# EAGLE design 1601_board_firmata_ft231x (EAGLE 9.6.2)
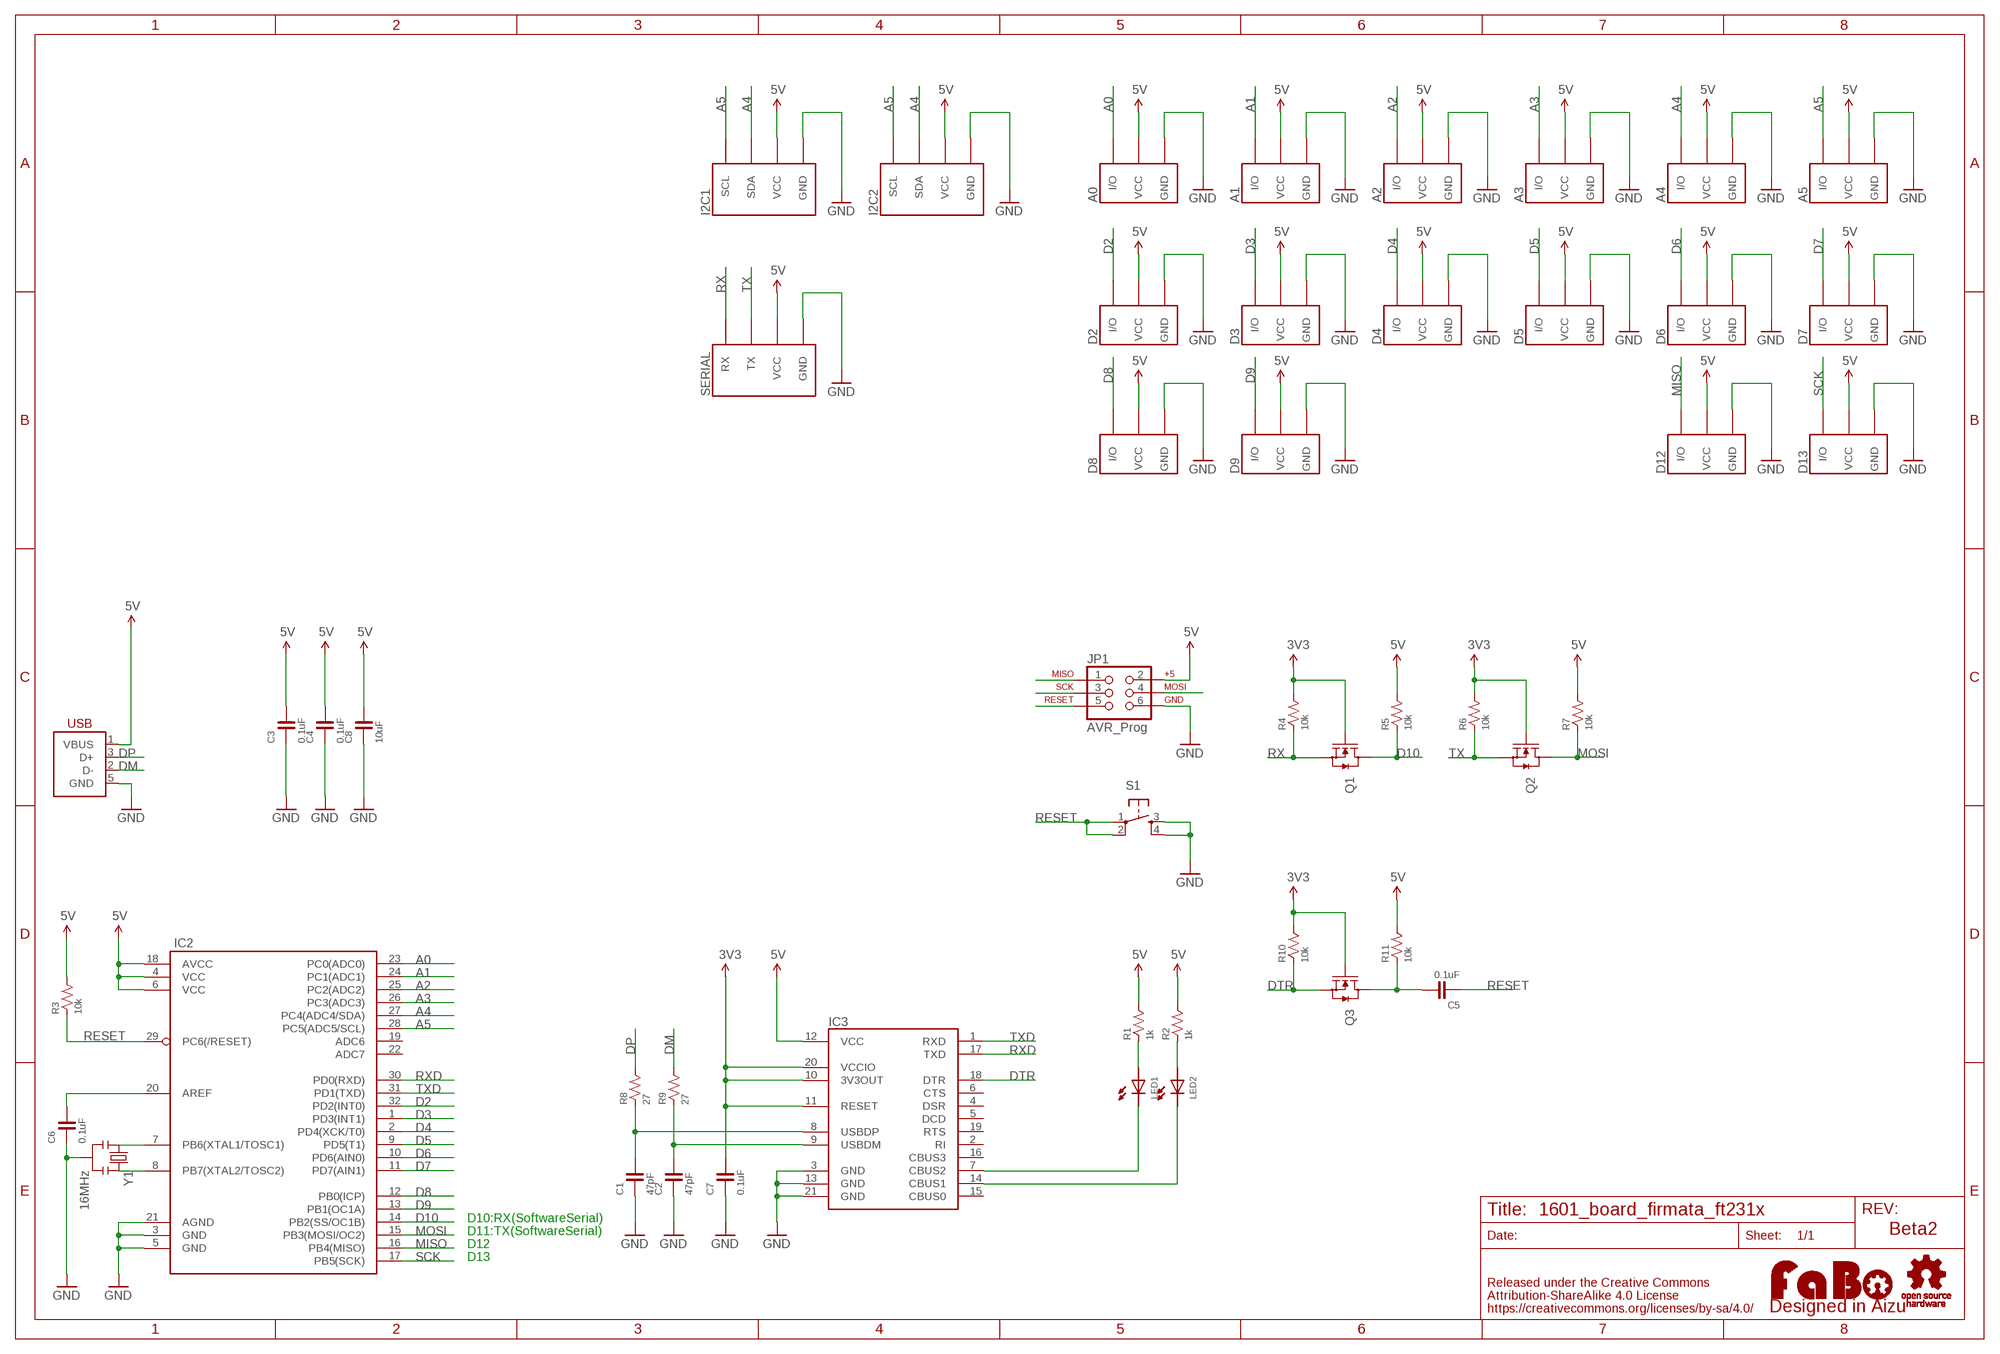
[diagram p0: schematic, sheet 1]

## Parts
A0  FABO_BRICK_3PIN-S03B-PASK-2  [FABO_BRICK_3PIN_S03B-PASK-2]
A1  FABO_BRICK_3PIN-S03B-PASK-2  [FABO_BRICK_3PIN_S03B-PASK-2]
A2  FABO_BRICK_3PIN-S03B-PASK-2  [FABO_BRICK_3PIN_S03B-PASK-2]
A3  FABO_BRICK_3PIN-S03B-PASK-2  [FABO_BRICK_3PIN_S03B-PASK-2]
A4  FABO_BRICK_3PIN-S03B-PASK-2  [FABO_BRICK_3PIN_S03B-PASK-2]
A5  FABO_BRICK_3PIN-S03B-PASK-2  [FABO_BRICK_3PIN_S03B-PASK-2]
C1  47pF  CAPACITOR-0603  [0603]
C2  47pF  CAPACITOR-0603  [0603]
C3  0.1uF  CAPACITOR-0603  [0603]
C4  0.1uF  CAPACITOR-0603  [0603]
C5  0.1uF  CAPACITOR-0603  [0603]
C6  0.1uF  CAPACITOR-0603  [0603]
C7  0.1uF  CAPACITOR-0603  [0603]
C8  10uF  CAPACITOR-0603  [0603]
D2  FABO_BRICK_3PIN-B03B-PASK-1  [FABO_BRICK_3PIN_B03B-PASK-1]
D3  FABO_BRICK_3PIN-B03B-PASK-1  [FABO_BRICK_3PIN_B03B-PASK-1]
D4  FABO_BRICK_3PIN-B03B-PASK-1  [FABO_BRICK_3PIN_B03B-PASK-1]
D5  FABO_BRICK_3PIN-B03B-PASK-1  [FABO_BRICK_3PIN_B03B-PASK-1]
D6  FABO_BRICK_3PIN-B03B-PASK-1  [FABO_BRICK_3PIN_B03B-PASK-1]
D7  FABO_BRICK_3PIN-B03B-PASK-1  [FABO_BRICK_3PIN_B03B-PASK-1]
D8  FABO_BRICK_3PIN-B03B-PASK-1  [FABO_BRICK_3PIN_B03B-PASK-1]
D9  FABO_BRICK_3PIN-B03B-PASK-1  [FABO_BRICK_3PIN_B03B-PASK-1]
D12  FABO_BRICK_3PIN-B03B-PASK-1  [FABO_BRICK_3PIN_B03B-PASK-1]
D13  FABO_BRICK_3PIN-B03B-PASK-1  [FABO_BRICK_3PIN_B03B-PASK-1]
I2C1  FABO_BRICK_I2C-S04B-PASK-2  [FABO_BRICK_I2C_S04B-PASK-2]
I2C2  FABO_BRICK_I2C-S04B-PASK-2  [FABO_BRICK_I2C_S04B-PASK-2]
IC2  ATMEGA328P-AU-TQFP32  [TQFP-32-08]
IC3  FT231XQ  [QFN-20]
JP1  AVR_Prog  AVR_ISP-TC  [TC2030-MCP]
LED1  LED-0603  [0603]
LED2  LED-0603  [0603]
Q1  MOSFET-N-BSS138  [SOT23-3]
Q2  MOSFET-N-BSS138  [SOT23-3]
Q3  MOSFET-N-BSS138  [SOT23-3]
R1  1k  RESISTOR-0603  [0603]
R2  1k  RESISTOR-0603  [0603]
R3  10k  RESISTOR-0603  [0603]
R4  10k  RESISTOR-0603  [0603]
R5  10k  RESISTOR-0603  [0603]
R6  10k  RESISTOR-0603  [0603]
R7  10k  RESISTOR-0603  [0603]
R8  27  RESISTOR-0603  [0603]
R9  27  RESISTOR-0603  [0603]
R10  10k  RESISTOR-0603  [0603]
R11  10k  RESISTOR-0603  [0603]
S1  TACT-SWITCH-SMD_KMR2  [KMR2]
SERIAL  FABO_BRICK_SERIAL-S04B-PASK-2  [FABO_BRICK_SERIAL_S04B-PASK-2]
U$2  LOGO_OSHW-T_M_BOTTOM  [LOGO_OSHW_T_MS_BOTTOM]
U$3  LOGO_FABO-M  [LOGO_FABO_MS]
USB2  USB-MICRO_B_SMT  [DX4R005JJ2R1800]
Y1  16MHz  RESONATOR  [RESONATOR_SMD]

## Nets
3V3: C7.2 IC3.10(3V3OUT) IC3.11(RESET) IC3.20(VCCIO) Q1.1(G) Q2.1(G) Q3.1(G) R4.2 R6.2 R10.2
5V: A0.VCC A1.VCC A2.VCC A3.VCC A4.VCC A5.VCC C3.2 C4.2 C8.2 D2.VCC D3.VCC D4.VCC D5.VCC D6.VCC D7.VCC D8.VCC D9.VCC D12.VCC D13.VCC I2C1.VCC I2C2.VCC IC2.4(VCC) IC2.6(VCC) IC2.18(AVCC) IC3.12(VCC) JP1.2 R1.2 R2.2 R3.2 R5.2 R7.2 R11.2 SERIAL.VCC USB2.1(VBUS)
A0: A0.I/O IC2.23(PC0(ADC0))
A1: A1.I/O IC2.24(PC1(ADC1))
A2: A2.I/O IC2.25(PC2(ADC2))
A3: A3.I/O IC2.26(PC3(ADC3))
A4: A4.I/O I2C1.SDA I2C2.SDA IC2.27(PC4(ADC4/SDA))
A5: A5.I/O I2C1.SCL I2C2.SCL IC2.28(PC5(ADC5/SCL))
D2: D2.I/O IC2.32(PD2(INT0))
D3: D3.I/O IC2.1(PD3(INT1))
D4: D4.I/O IC2.2(PD4(XCK/T0))
D5: D5.I/O IC2.9(PD5(T1))
D6: D6.I/O IC2.10(PD6(AIN0))
D7: D7.I/O IC2.11(PD7(AIN1))
D8: D8.I/O IC2.12(PB0(ICP))
D9: D9.I/O IC2.13(PB1(OC1A))
D10: IC2.14(PB2(SS/OC1B)) Q1.3(D) R5.1
DM: R9.2 USB2.2(D-)
DP: R8.2 USB2.3(D+)
DTR: IC3.18(DTR) Q3.2(S) R10.1
GND: A0.GND A1.GND A2.GND A3.GND A4.GND A5.GND C1.1 C2.1 C3.1 C4.1 C6.1 C7.1 C8.1 D2.GND D3.GND D4.GND D5.GND D6.GND D7.GND D8.GND D9.GND D12.GND D13.GND I2C1.GND I2C2.GND IC2.3(GND) IC2.5(GND) IC2.21(AGND) IC3.3(GND) IC3.13(GND) IC3.21(GND) JP1.6 S1.3 S1.4 SERIAL.GND USB2.5(GND) Y1.2
MISO: D12.I/O IC2.16(PB4(MISO)) JP1.1
MOSI: IC2.15(PB3(MOSI/OC2)) JP1.4 Q2.3(D) R7.1
N$1: LED1.ANODE R1.1
N$2: C6.2 IC2.20(AREF)
N$3: IC2.8(PB7(XTAL2/TOSC2)) Y1.3
N$4: IC2.7(PB6(XTAL1/TOSC1)) Y1.1
N$5: C1.2 IC3.8(USBDP) R8.1
N$6: C2.2 IC3.9(USBDM) R9.1
N$7: IC3.14(CBUS1) LED2.CATHODE
N$8: IC3.7(CBUS2) LED1.CATHODE
N$9: C5.2 Q3.3(D) R11.1
N$30: LED2.ANODE R2.1
RESET: C5.1 IC2.29(PC6(/RESET)) JP1.5 R3.1 S1.1 S1.2
RX: Q1.2(S) R4.1 SERIAL.RX
RXD: IC2.30(PD0(RXD)) IC3.17(TXD)
SCK: D13.I/O IC2.17(PB5(SCK)) JP1.3
TX: Q2.2(S) R6.1 SERIAL.TX
TXD: IC2.31(PD1(TXD)) IC3.1(RXD)
Unconnected: IC2.19(ADC6) IC2.22(ADC7) IC3.2(RI) IC3.4(DSR) IC3.5(DCD) IC3.6(CTS) IC3.15(CBUS0) IC3.16(CBUS3) IC3.19(RTS)

## Notes on the sheet
- D10:RX(SoftwareSerial)
- D11:TX(SoftwareSerial) | Beta2
- D12
- D13

## Library data of the parts
A0 A1-A5 D2-D9 D12 D13 = FaBo-Template:FABO_BRICK_3PIN: FaBo Brick 3pin
C1-C8 = FaBo-Capacitor:CAPACITOR: CAPACITOR
I2C1 I2C2 = FaBo-Template:FABO_BRICK_I2C: FaBo Brick I2C
IC2 = FaBo-etc:ATMEGA328P-AU: ATmega328p-AU
IC3 = FaBo-etc:FT231X
JP1 = Gclue:AVR_ISP
LED1 LED2 = FaBo-LED:LED
Q1-Q3 = FaBo-etc:MOSFET-N
R1-R11 = FaBo-Resistors:RESISTOR: RESISTOR
S1 = FaBo-Switch:TACT-SWITCH
SERIAL = FaBo-Template:FABO_BRICK_SERIAL: FaBo Brick Serial
U$2 = FaBo-etc:LOGO_OSHW
U$3 = FaBo-Logo:LOGO_FABO
USB2 = FaBo-etc:USB
Y1 = Gclue:RESONATOR: RESONATOR CSTCE16M0V53

## Board
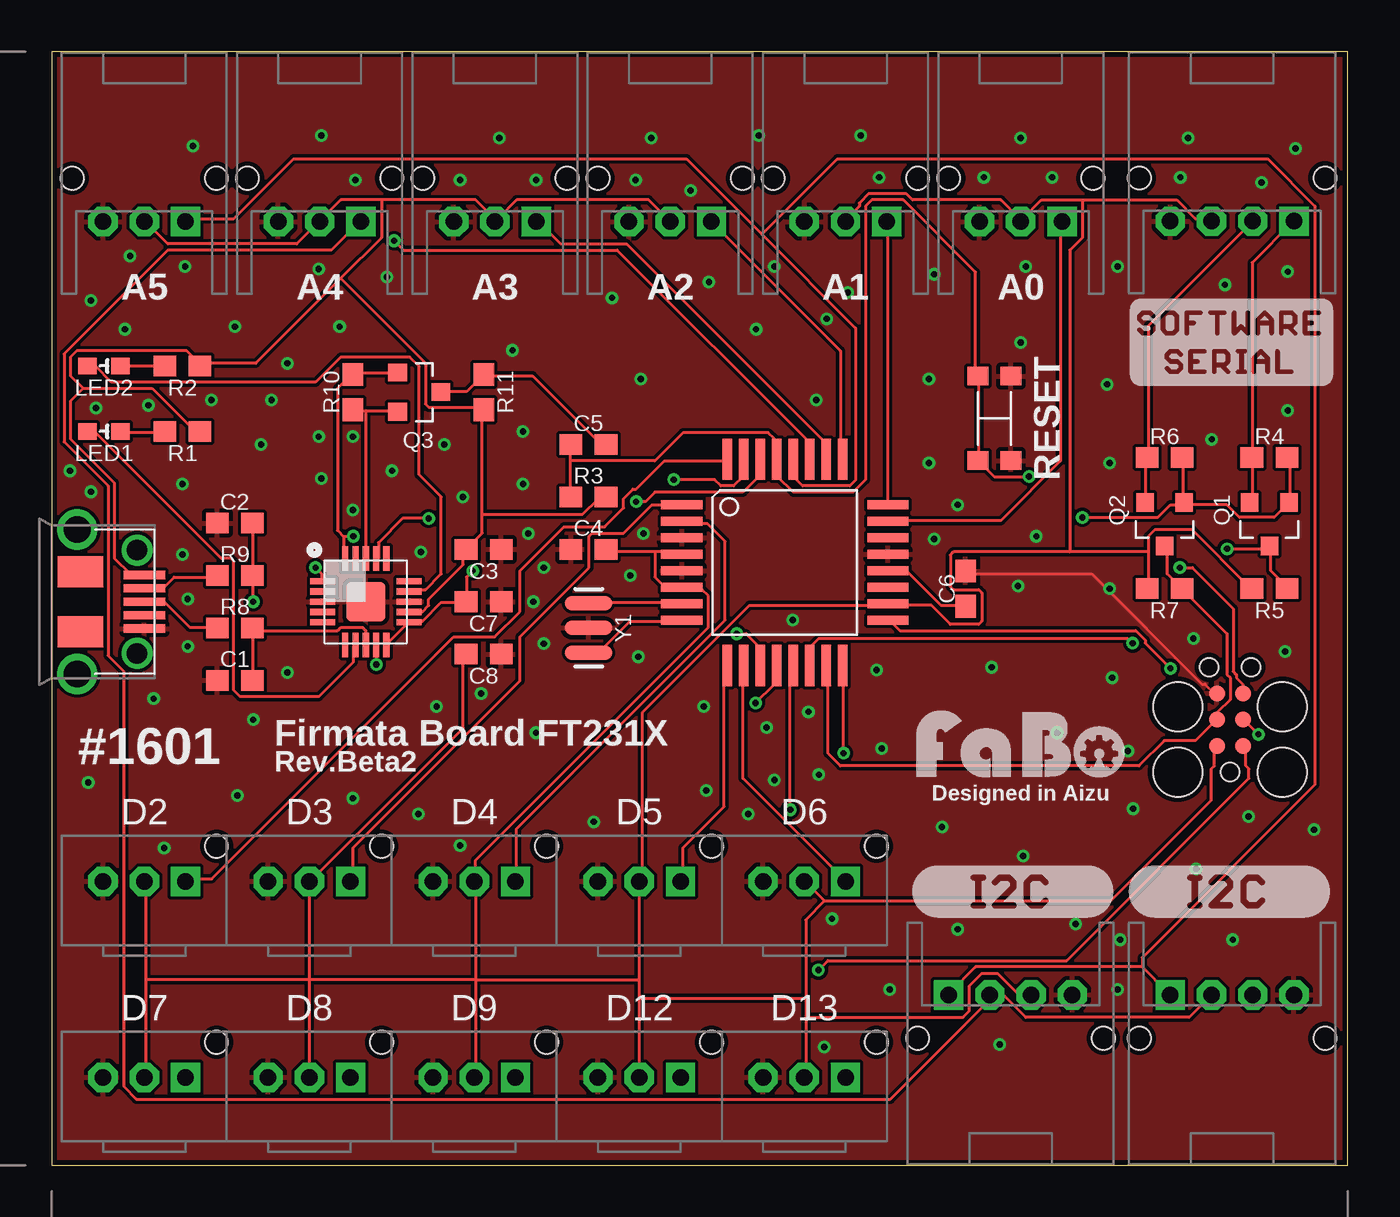
[diagram p1: board, top side]
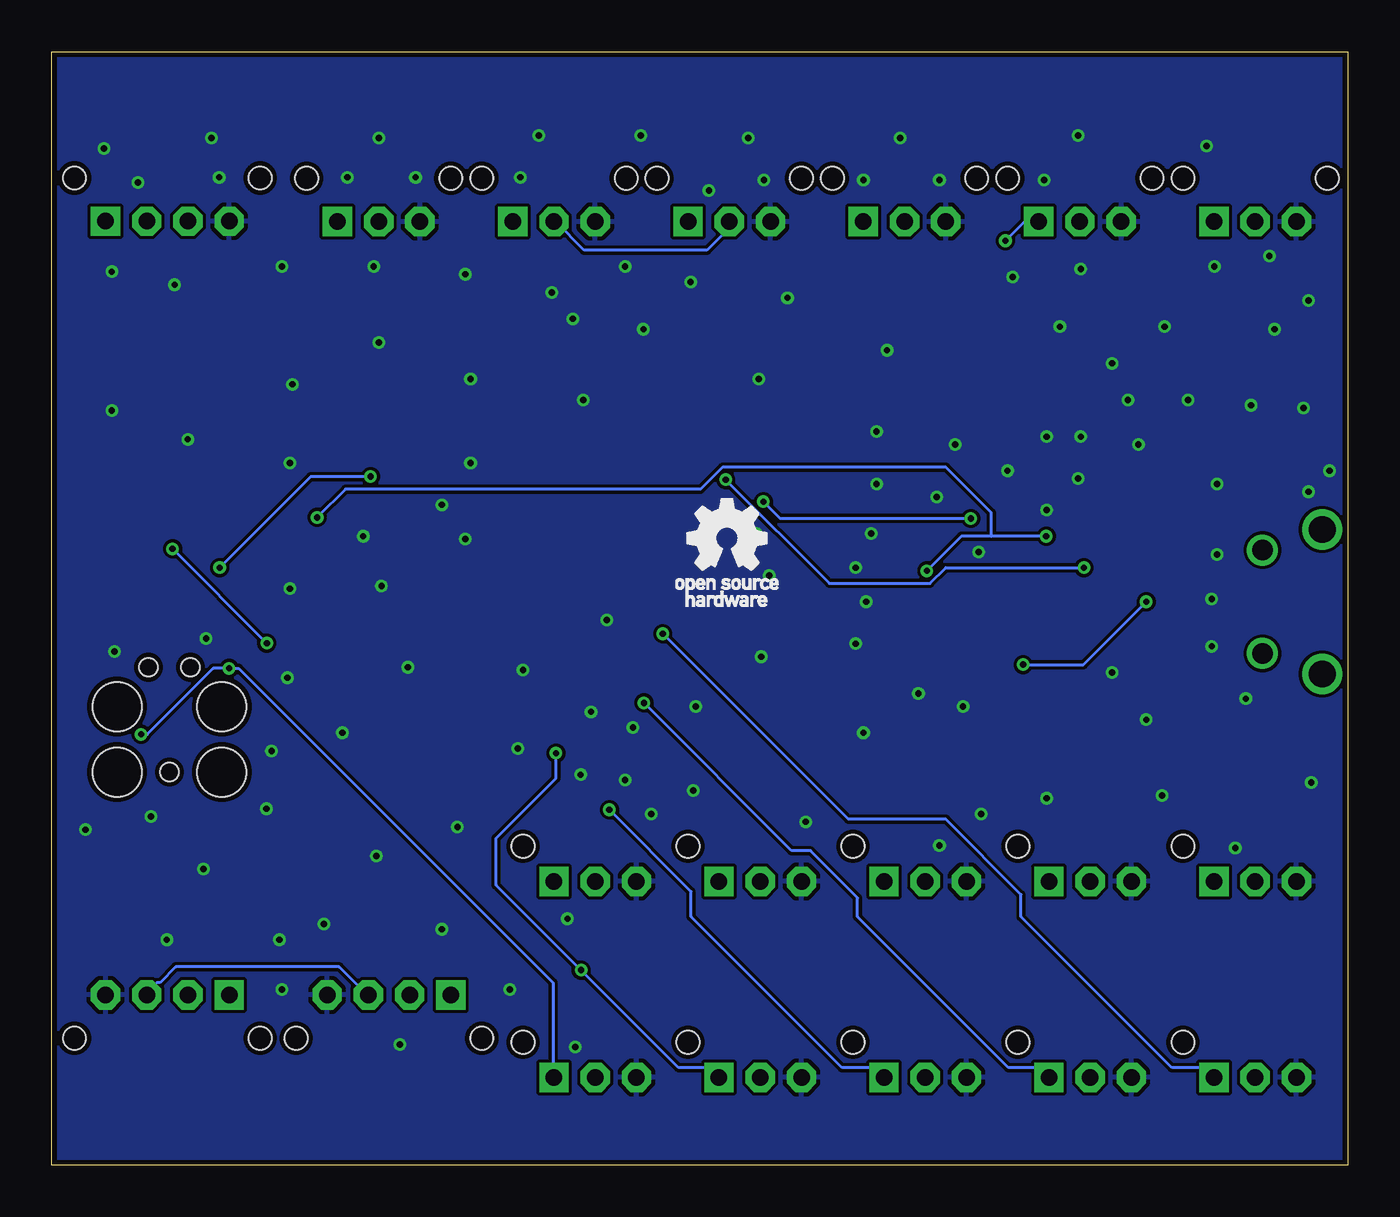
[diagram p2: board, bottom side, seen from below]

Size 62.87 x 53.98 mm. Coordinates in mm from the lower left corner, seen from the top.
Outline: 0,0 62.87,0 62.87,53.98 0,53.98 0,0
Copper layers (1*16): Top 0.035mm / dielectric 1.6mm / Bottom 0.035mm
Design rules "PCBway": minimum track width 6mil, minimum drill 12mil, track to track 6mil, track to pad 6mil, pad to pad 6mil, via to via 6mil, smd to smd 6mil, copper to edge 10mil, drill to drill 10mil, minimum pad ring 10mil, minimum via ring 6mil, stop-mask expansion 2mil, vias tented up to drill 100mil, thermal gap 8mil

### Footprints (pad centres in the part's own frame; a part is rotated, then mirrored left to right if it is on the bottom)
FABO_BRICK_3PIN_S03B-PASK-2 = drill 0.8 pad 1.422 octagon: GND -2,0; VCC 0,0 | drill 0.8 pad 1.422 square: I/O 2,0 | hole 1.1: 3.5,2.1; -3.5,2.1
0603 = smd 1.1 x 1: 1 -0.85,0; 2 0.85,0
FABO_BRICK_3PIN_B03B-PASK-1 = drill 0.8 pad 1.422 octagon: GND -2,0; VCC 0,0 | drill 0.8 pad 1.422 square: I/O 2,0 | hole 1.1: 3.5,1.7
FABO_BRICK_I2C_S04B-PASK-2 = drill 0.8 pad 1.422 octagon: GND -3,0; SDA 1,0; VCC -1,0 | drill 0.8 pad 1.422 square: SCL 3,0 | hole 1.1: 4.5,2.1; -4.5,2.1
TQFP-32-08 = smd 2 x 0.45: 1 -5,2.8; 2 -5,2; 3 -5,1.2; 4 -5,0.4; 5 -5,-0.4; 6 -5,-1.2; 7 -5,-2; 8 -5,-2.8; 17 5,-2.8; 18 5,-2; 19 5,-1.2; 20 5,-0.4; 21 5,0.4; 22 5,1.2; 23 5,2; 24 5,2.8 | smd 0.45 x 2: 9 -2.8,-5; 10 -2,-5; 11 -1.2,-5; 12 -0.4,-5; 13 0.4,-5; 14 1.2,-5; 15 2,-5; 16 2.8,-5; 25 2.8,5; 26 2,5; 27 1.2,5; 28 0.4,5; 29 -0.4,5; 30 -1.2,5; 31 -2,5; 32 -2.8,5
QFN-20 = smd 1.2 x 0.3: 1 -2.1,1; 2 -2.1,0.5; 3 -2.1,0; 4 -2.1,-0.5; 5 -2.1,-1; 11 2.1,-1; 12 2.1,-0.5; 13 2.1,0; 14 2.1,0.5; 15 2.1,1 | smd 0.3 x 1.2: 6 -1,-2.1; 7 -0.5,-2.1; 8 0,-2.1; 9 0.5,-2.1; 10 1,-2.1; 16 1,2.1; 17 0.5,2.1; 18 0,2.1; 19 -0.5,2.1; 20 -1,2.1 | smd 1.9 x 1.9: 21 0,0
TC2030-MCP = smd 0.787 x 0.787: 1 -1.27,-0.635; 2 -1.27,0.635; 3 0,-0.635; 4 0,0.635; 5 1.27,-0.635; 6 1.27,0.635 | hole 0.889: -2.54,0; 2.54,-1.016; 2.54,1.016 | hole 2.375: -2.54,2.54; -2.54,-2.54; 0.635,-2.54; 0.635,2.54
0603' = smd 0.9 x 0.8: ANODE -0.8,0; CATHODE 0.8,0
SOT23-3 = smd 0.85 x 0.9: 1 -0.95,-1; 2 0.95,-1; 3 0,1.1
KMR2 = smd 0.9 x 1: 1 -2.05,0.8; 2 2.05,0.8; 3 2.05,-0.8; 4 -2.05,-0.8
FABO_BRICK_SERIAL_S04B-PASK-2 = drill 0.8 pad 1.422 octagon: GND -3,0; TX 1,0; VCC -1,0 | drill 0.8 pad 1.422 square: RX 3,0 | hole 1.1: 4.5,2.1; -4.5,2.1
DX4R005JJ2R1800 = smd 0.4 x 2: 1 -1.3,4.5; 2 -0.65,4.5; 3 0,4.5; 4 0.65,4.5; 5 1.3,4.5 | smd 1.5 x 2.2: 6 -1.45,1.4; 7 1.45,1.4 | drill 1 pad 1.4: P$1 -2.5,4.15; P$2 2.5,4.15 | drill 1.3 pad 1.7: P$3 -3.5,1.25; P$4 3.5,1.25
RESONATOR_SMD = smd 0.7 x 2.3: 1 -1.2,0; 2 0,0; 3 1.2,0

### Placement (x,y rotation side)
A0  47,45.73 0 top
A1  38.5,45.73 0 top
A2  30,45.73 0 top
A3  21.5,45.73 0 top
A4  13,45.73 0 top
A5  4.5,45.73 0 top
C1  8.89,23.5 0 top
C2  8.89,31.11 0 top
C3  20.95,29.84 180 top
C4  26.04,29.84 0 top
C5  26.04,34.92 0 top
C6  44.32,27.94 270 top
C7  20.95,27.3 180 top
C8  20.95,24.77 180 top
D2  4.5,13.75 0 top
D3  12.5,13.75 0 top
D4  20.5,13.75 0 top
D5  28.5,13.75 0 top
D6  36.5,13.75 0 top
D7  4.5,4.25 0 top
D8  12.5,4.25 0 top
D9  20.5,4.25 0 top
D12  28.5,4.25 0 top
D13  36.5,4.25 0 top
I2C1  46.5,8.25 180 top
I2C2  57.25,8.25 180 top
IC2  35.56,29.21 0 top
IC3  15.24,27.3 0 top
JP1  57.15,21.59 90 top
LED1  [0603']  2.54,35.56 180 top
LED2  [0603']  2.54,38.73 180 top
Q1  59.05,31.11 180 top
Q2  53.98,31.11 180 top
Q3  17.78,37.47 270 top
R1  6.35,35.56 0 top
R2  6.35,38.73 0 top
R3  26.04,32.38 0 top
R4  59.05,34.29 0 top
R5  59.05,27.94 180 top
R6  53.98,34.29 0 top
R7  53.98,27.94 180 top
R8  8.89,26.04 180 top
R9  8.89,28.57 180 top
R10  14.61,37.47 90 top
R11  20.95,37.47 270 top
S1  45.72,36.2 90 top
SERIAL  57.25,45.75 0 top
U$2  30.1,30.35 0 top
U$3  46.99,18.41 0 top
U$4  [LOGO_SILK_I2C]  52.25,12 0 top
U$5  [LOGO_SILK_SERIAL]  52.17,37.65 0 top
U$6  [LOGO_SILK_I2C]  41.75,12 0 top
USB2  0,27.3 270 top
Y1  26.04,26.04 270 top

### Tracks (layer width: path | path; a pad name or v marks a point on that pad's centre or on a via)
3V3  (via drill 0.3)
  Top 0.152: Q2.1 54.86,32.16 54.86,34.29 R6.2 | R4.2 60.05,34.29 60.05,32.16 Q1.1 59.89,32 59.28,31.39 57.61,31.39 57,32 55.02,32 Q2.1 | IC3.10 16.31,25.3 17.22,26.21 IC3.11 17.37,26.36 17.98,26.36 18.9,27.28 19.96,27.28 C7.2 20.12,27.43 20.12,28.5 v20.42,28.8 | Q3.1 16.76,38.41 14.63,38.41 R10.2 14.48,38.25 13.87,37.64 13.87,30.76 14.17,30.45 | 14.17,30.45 14.17,30.48 v14.63,30.48 | 14.17,30.45 14.17,29.41 IC3.20 | v49.99,31.39 53.65,31.39 54.25,32 54.86,32 Q2.1
  Bottom 0.152: v20.42,28.8 18.75,30.48 17.3,30.48 | v14.63,30.48 17.3,30.48 | v49.99,31.39 48.62,32.77 31.39,32.77 30.33,33.83 19.51,33.83 17.3,31.62 17.3,30.48
5V
  Top 0.152: 53.19,29.72 53.19,30.48 53.49,30.79 55.32,30.79 58.06,28.04 R5.2 | 53.19,29.72 53.19,28.04 R7.2 | 53.19,29.72 49.38,29.72 | 49.38,29.72 43.74,29.72 43.59,29.57 43.59,28.04 43.74,27.89 44.96,27.89 45.11,27.74 45.11,26.36 44.96,26.21 43.59,26.21 42.67,27.13 40.69,27.13 IC2.18 40.54,27.13 33.83,27.13 28.65,21.95 28.65,13.87 D5.VCC 28.5,13.72 28.5,8.99 | A1.VCC 38.56,45.87 39.17,46.48 39.17,46.63 39.62,47.09 41.45,47.09 41.76,46.79 46.02,46.79 46.94,45.87 A0.VCC 47.09,45.87 48.01,46.79 49.99,46.79 | 49.99,46.79 54.56,46.79 55.47,45.87 56.24,45.87 SERIAL.VCC | 49.38,29.72 49.38,44.35 49.99,44.96 49.99,46.79 | IC3.12 17.37,26.82 17.98,26.82 18.29,27.13 18.29,27.43 19.96,29.11 19.96,29.72 C3.2 20.12,29.87 20.88,30.63 20.88,31.55 | 20.88,31.55 20.88,36.58 R11.2 20.88,36.73 18.29,36.73 18.14,36.88 18.14,38.86 14.02,42.98 | 20.88,31.55 25.76,31.55 26.52,32.31 26.82,32.31 R3.2 | 1.52,37.64 4.88,37.64 6.86,35.66 7.16,35.66 R1.2 | 1.52,37.64 0.91,38.25 0.91,39.17 1.22,39.47 6.55,39.47 7.16,38.86 R2.2 7.32,38.86 9.91,38.86 14.02,42.98 | 1.52,37.64 0.91,37.03 0.91,35.2 3.05,33.07 3.05,29.41 3.81,28.65 4.42,28.65 USB2.1 | A5.VCC 4.57,45.72 5.64,44.65 11.89,44.65 12.95,45.72 A4.VCC 13.11,45.87 14.02,46.79 16,46.79 | A2.VCC 29.87,45.87 28.96,46.79 22.55,46.79 21.64,45.87 A3.VCC 21.49,45.87 20.57,46.79 16,46.79 | 14.02,42.98 16,44.96 16,46.79 | 37.49,12.8 51.36,12.8 56.24,17.68 56.24,19.2 56.39,19.36 56.39,20.27 JP1.2 | 37.49,12.8 36.58,13.72 D6.VCC | 36.58,8.08 36.58,11.89 37.49,12.8 | 36.58,8.08 36.58,7.16 | 36.58,7.16 36.58,4.27 D13.VCC | 36.58,7.16 44.2,7.16 44.5,7.47 44.5,8.69 45.11,9.3 45.87,9.3 46.79,8.38 47.4,8.38 I2C1.VCC
  Top 0.152: 4.57,8.99 4.57,13.72 D2.VCC | 4.57,8.99 4.57,4.27 D7.VCC | C8.2 19.96,24.69 19.96,21.18 12.65,13.87 D3.VCC 12.5,13.72 12.5,8.99 | 12.5,8.99 12.5,4.27 D8.VCC | 12.5,8.99 4.57,8.99 | 28.5,8.99 28.5,8.08 | 28.5,8.08 28.5,4.27 D12.VCC | 29.26,29.72 30.48,29.72 IC2.4 | 29.26,29.72 26.98,29.72 C4.2 | 29.26,29.72 29.26,28.5 29.72,28.04 30.48,28.04 IC2.6 30.63,27.89 31.55,27.89 31.85,27.58 31.85,26.06 20.57,14.78 20.57,13.87 D4.VCC 20.57,13.72 20.57,8.99 | 20.57,8.99 20.57,4.27 D9.VCC | 20.57,8.99 28.5,8.99 | 20.57,8.99 12.5,8.99 | 28.5,8.08 36.58,8.08
  Bottom 0.152: A1.VCC 38.41,45.72 37.03,44.35 31.09,44.35 30.02,45.41 30.02,45.72 A2.VCC | I2C2.VCC 58.22,8.38 57.76,8.84 57.61,8.84 56.84,9.6 48.92,9.6 47.55,8.23 I2C1.VCC
A0
  Top 0.152: IC2.23 40.69,31.24 46.02,31.24 48.92,34.14 48.92,45.72 A0.I/O
A1
  Top 0.152: IC2.24 40.54,32.16 40.54,45.72 A1.I/O
A2
  Top 0.152: IC2.25 38.25,34.29 38.25,39.47 A2.I/O
A3
  Top 0.152: IC2.26 37.49,34.29 37.49,35.05 27.89,44.65 24.69,44.65 23.62,45.72 A3.I/O
A4  (via drill 0.3)
  Top 0.152: I2C2.SDA 56.24,8.23 55.17,7.16 47.24,7.16 46.18,8.23 45.57,8.23 I2C1.SDA 45.41,8.23 45.41,7.92 40.69,3.2 4.12,3.2 3.5,3.81 3.5,23.93 2.74,24.69 2.74,32.92 0.61,35.05 0.61,39.32 5.64,44.35 13.56,44.35 14.94,45.72 A4.I/O | v16.61,44.81 17.07,44.35 27.43,44.35 36.73,35.05 36.73,34.29 IC2.27
  Bottom 0.152: v16.61,44.81 15.7,45.72 15.09,45.72 A4.I/O
A5
  Top 0.152: 52.88,9.6 44.81,9.6 43.59,8.38 I2C1.SCL | 52.88,9.6 54.1,8.38 I2C2.SCL | 34.44,45.11 30.79,48.77 11.73,48.77 8.84,45.87 6.55,45.87 A5.I/O | 34.44,45.11 38.99,40.56 38.99,33.2 38.71,32.92 36.42,32.92 35.97,33.38 35.97,34.14 IC2.28 | 52.88,9.6 52.88,10.06 61.27,18.44 61.27,46.48 58.98,48.77 38.1,48.77 34.44,45.11
D2
  Top 0.152: IC2.32 32.61,34.14 29.72,34.14 28.35,32.77 28.19,32.77 27.74,32.31 27.74,31.85 26.82,30.94 24.84,30.94 22.71,28.8 22.71,26.82 21.49,25.6 19.51,25.6 7.77,13.87 6.55,13.87 D2.I/O
D3
  Top 0.152: IC2.1 30.48,32 29.11,32 27.74,30.63 26.21,30.63 26.06,30.48 26.06,28.96 22.71,25.6 22.71,23.47 14.63,15.39 14.63,13.87 D3.I/O
D4
  Top 0.152: IC2.2 30.63,31.09 31.8,31.09 32.66,30.23 32.66,26.42 22.55,16.31 22.55,13.87 D4.I/O
D5
  Top 0.152: IC2.9 32.61,24.08 32.61,17.37 30.63,15.39 30.63,13.87 D5.I/O
D6
  Top 0.152: IC2.10 33.53,24.08 33.53,18.75 38.41,13.87 D6.I/O
D7  (via drill 0.3)
  Top 0.152: v33.22,25.76 33.68,25.76 34.29,25.15 34.29,24.23 IC2.11
  Bottom 0.152: v33.22,25.76 24.23,16.76 19.51,16.76 15.85,13.11 15.85,12.04 8.53,4.72 7.01,4.72 6.55,4.27 D7.I/O
D8  (via drill 0.3)
  Top 0.152: v34.14,22.4 35.05,23.32 35.05,24.08 IC2.12
  Bottom 0.152: v34.14,22.4 26.98,15.24 26.06,15.24 23.77,12.95 23.77,12.04 16.46,4.72 15.09,4.72 14.63,4.27 D8.I/O
D9  (via drill 0.3)
  Top 0.152: v35.81,17.22 35.81,24.08 IC2.13
  Bottom 0.152: v35.81,17.22 31.85,13.26 31.85,12.04 24.54,4.72 23.01,4.72 22.55,4.27 D9.I/O
D10  (via drill 0.3)
  Top 0.152: R5.1 59.89,28.04 59.13,28.8 59.13,29.87 Q1.3 58.98,29.87 v57,29.87 | IC2.14 36.88,24.23 36.88,25.2 37.21,25.53 52.15,25.53 v52.43,25.3
  Bottom 0.152: v52.43,25.3 v57,29.87
DM
  Top 0.152: R9.2 7.92,28.5 5.94,28.5 5.49,28.04 4.57,28.04 USB2.2
DP
  Top 0.152: R8.2 7.92,26.06 6.71,26.06 5.49,27.28 4.57,27.28 USB2.3
DTR
  Top 0.152: 15.24,36.58 14.63,36.58 R10.1 | 15.24,36.58 16.76,36.58 Q3.2 | 15.24,36.58 IC3.18
GND  (via drill 0.3)
  Top 0.152: JP1.6 56.39,22.86 55.93,23.32 55.78,23.32 50.44,28.65 44.35,28.65 C6.1
  other vias: 28.57,38.1 42.55,38.1 13.97,40.64 8.89,40.64 10.16,34.92 16.51,33.66 22.86,35.56 22.86,33.02 19.05,34.92 17.91,29.72 11.43,23.88 6.6,27.43 6.35,29.59 6.35,33.02 13.08,33.27 14.61,35.31 14.61,31.75 12.95,35.31 11.43,38.86 10.67,37.08 7.75,37.08 4.7,36.83 2.16,36.7 0.89,33.66 1.91,32.64 3.56,40.51 1.91,41.91 3.81,44.07 6.48,43.56 6.6,25.15 4.95,22.61 9.78,21.59 14.61,17.78 18.67,22.23 20.83,22.86 19.94,32.38 23.11,30.61 23.88,25.27 28.07,28.57 28.7,30.61 23.88,28.96 23.37,27.3 22.35,39.5 37.08,37.08 31.88,42.8 27.18,42.04 42.55,34.04 42.8,43.18 47.24,43.56 51.69,43.56 51.18,37.85 46.99,39.88 56.9,42.67 59.94,43.31 59.94,36.58 56.26,35.18 51.31,34.04 51.31,27.94 46.86,28.07 42.8,30.35 47.75,30.48 40.01,24 40.26,20.19 52.2,20.07 51.44,23.62 48.77,20.95 36.7,21.97 34.67,21.21 37.21,18.92 35.05,18.67 33.78,17.02 31.75,18.16 31.62,22.23 28.45,24.64 23.5,20.95 17.78,17.02 19.81,15.49 26.29,16.64 9.02,17.91 5.46,15.37 1.78,18.54 37.85,11.94 43.18,16.38 52.45,17.27 58.04,16.89 49.66,11.68 51.82,10.92 40.64,8.51 37.47,5.71 45.97,5.84 57.28,10.92 51.69,8.51 45.59,24.13 55.37,25.53 59.82,24.89 43.94,32 35.94,26.42 34.16,40.51 37.59,41.02 38.61,42.29 35.05,43.56 30.99,47.24 28.32,47.75 23.5,47.75 19.81,47.75 14.73,47.75 40.13,47.88 45.21,47.88 48.51,47.88 54.74,47.88 58.67,47.62 60.33,49.28 55.12,49.78 46.99,49.78 39.24,49.91 34.29,49.91 29.08,49.78 21.72,49.78 13.08,49.91 6.86,49.4 16.26,43.05 12.95,43.43 55.5,14.35 43.94,11.43 61.21,16.26 47.12,14.99
  pour Top: 0,0 62.87,0 62.87,53.98 0,53.98
  pour Bottom: 0,0 62.87,0 62.87,53.98 0,53.98
MISO  (via drill 0.3)
  Top 0.152: v37.19,9.45 37.64,9.91 49.23,9.91 58.06,18.75 58.06,19.2 57.91,19.36 57.91,20.27 JP1.1 | v38.41,19.96 38.41,24.08 IC2.16
  Bottom 0.152: D12.I/O 30.63,4.27 31.09,4.72 32.46,4.72 v37.19,9.45 41.3,13.56 41.3,15.85 38.41,18.75 v38.41,19.96
MOSI
  Top 0.152: Q2.3 54.1,29.87 54.1,28.65 54.71,28.04 R7.1 54.86,27.89 57,25.76 57,23.77 57.15,23.62 57.15,22.55 56.54,21.95 56.54,21.64 JP1.4 56.39,21.49 55.47,20.57 53.95,20.57 52.73,19.36 38.25,19.36 37.64,19.96 37.64,24.08 IC2.15
N$1
  Top 0.152: LED1.ANODE 3.35,35.51 5.49,35.51 R1.1
N$2
  Top 0.152: C6.2 44.2,27.13 43.13,27.13 41.45,28.8 40.69,28.8 IC2.20
N$3
  Top 0.152: IC2.8 30.48,26.36 28.04,26.36 26.52,24.84 26.06,24.84 Y1.3
N$4
  Top 0.152: IC2.7 30.48,27.28 26.06,27.28 Y1.1
N$5
  Top 0.152: 9.75,25.91 9.75,23.62 C1.2 | IC3.8 15.24,25.91 15.09,26.06 14.02,26.06 13.87,25.91 9.75,25.91 | 9.75,25.91 R8.1
N$6  (via drill 0.3)
  Top 0.152: C2.2 9.75,31.09 9.75,28.65 R9.1 9.78,28.54 v9.78,27.3 | IC3.9 v15.75,24.26
  Bottom 0.152: v15.75,24.26 12.83,24.26 v9.78,27.3
N$7
  Top 0.152: LED2.CATHODE 1.83,38.71 2.13,38.71 2.9,37.95 12.8,37.95 14.02,39.17 17.37,39.17 17.83,38.71 17.83,33.45 18.9,32.38 18.9,28.65 18.14,27.89 17.37,27.89 IC3.14
N$8
  Top 0.152: LED1.CATHODE 1.83,35.51 2.13,35.51 8.23,29.41 8.69,29.41 8.84,29.26 8.84,23.01 9.14,22.71 12.95,22.71 14.63,24.38 14.63,25.15 IC3.7
N$9
  Top 0.152: Q3.3 18.9,37.49 20.12,37.49 20.88,38.25 R11.1 21.03,38.25 23.32,38.25 26.52,35.05 26.82,35.05 C5.2
N$30
  Top 0.152: LED2.ANODE 3.35,38.71 5.49,38.71 R2.1
RESET  (via drill 0.3)
  Top 0.152: 25.15,34.14 25.15,34.9 C5.1 | 25.15,34.14 25.15,32.46 R3.1 | 25.15,34.14 29.26,34.14 30.63,35.51 34.75,35.51 35.05,35.2 35.05,34.29 IC2.29 35.2,34.14 35.2,33.38 35.97,32.61 38.86,32.61 39.47,33.22 39.47,46.48 39.78,46.79 41.3,46.79 44.81,43.28 44.81,38.25 S1.2 44.96,38.1 44.96,34.29 S1.1 44.96,34.14 45.72,33.38 v47.4,33.38 | v54.71,28.96 55.32,28.96 57.3,26.98 57.3,23.93 57.45,23.77 57.45,23.62 57.76,23.32 57.76,22.86 JP1.5
  Bottom 0.152: v54.71,28.96 50.29,33.38 v47.4,33.38
RX
  Top 0.152: 58.22,34.29 58.22,32.16 Q1.2 | 58.22,34.29 58.22,43.74 60.2,45.72 SERIAL.RX | 58.22,34.29 R4.1
RXD  (via drill 0.3)
  Top 0.152: v18.29,31.34 17.02,31.34 15.85,30.18 15.85,29.41 IC3.17 | v28.35,32.16 28.8,32.16 29.26,32.61 33.53,32.61 34.29,33.38 34.29,34.14 IC2.30
  Bottom 0.152: v18.29,31.34 27.53,31.34 v28.35,32.16
SCK  (via drill 0.3)
  Top 0.152: v58.52,20.88 57.91,21.49 JP1.3 | v54.25,24.08 53.03,25.3 53.03,25.45 52.58,25.91 41.15,25.91 40.69,26.36 IC2.17
  Bottom 0.152: v58.52,20.88 58.22,20.88 55.02,24.08 v54.25,24.08 53.8,24.08 38.56,8.84 38.56,4.27 D13.I/O
TX
  Top 0.152: Q2.2 53.03,32.16 53.03,34.29 R6.1 53.19,34.29 53.19,40.69 58.22,45.72 SERIAL.TX
TXD  (via drill 0.3)
  Top 0.152: v12.8,28.96 13.11,28.65 13.11,28.35 IC3.1 | v30.18,33.22 32.16,33.22 32.46,32.92 33.07,32.92 33.53,33.38 33.53,34.14 IC2.31
  Bottom 0.152: v12.8,28.96 19.51,28.96 20.27,28.19 25.15,28.19 v30.18,33.22

### Text on the board
tPlace: RESET | #1601 | Firmata Board FT231X | Rev.Beta2 | Designed in Aizu